# Altium schematic sheet VTRX.SchDoc: VTRX+
size A; DocumentNumber: 7; SheetNumber: 7; SheetTotal: 22
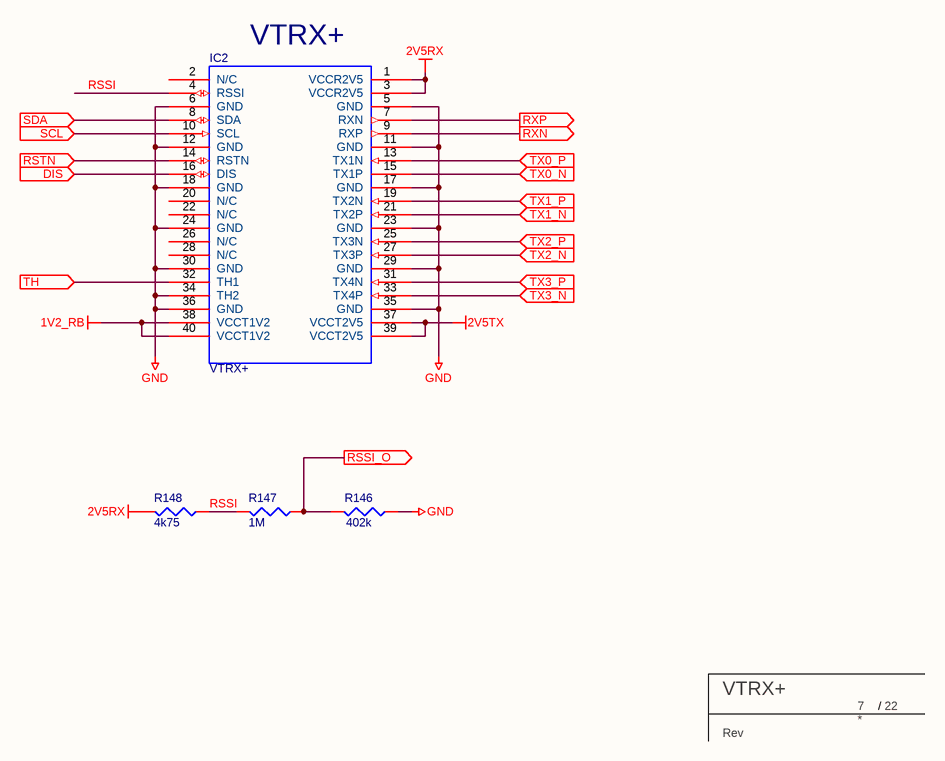
[diagram p0: VTRX.SchDoc]

## Parts
IC2  DF40C-40DS-0.4V  [vtrx+]  (value not drawn)
R146  402k  [R_0402_IPC]
R147  1M  [R_0402_IPC]
R148  4k75  [R_0402_IPC]
TBLOCK?  BU Title block  (value not drawn)  (graphical)

## Ports
DIS (in), RSSI_O (out), RSTN (in), RXN (out), RXP (out), SCL (in), SDA (in), TH (in), TX0_N (in), TX0_P (in), TX1_N (in), TX1_P (in), TX2_N (in), TX2_P (in), TX3_N (in), TX3_P (in)

## Nets
1V2_RB: IC2.38(VCCT1V2) IC2.40(VCCT1V2)
2V5RX: IC2.1(VCCR2V5) IC2.3(VCCR2V5) R148.2
2V5TX: IC2.37(VCCT2V5) IC2.39(VCCT2V5)
GND: IC2.5(GND) IC2.6(GND) IC2.11(GND) IC2.12(GND) IC2.17(GND) IC2.18(GND) IC2.23(GND) IC2.24(GND) IC2.29(GND) IC2.30(GND) IC2.34(TH2) IC2.35(GND) IC2.36(GND) R146.1
DIS: IC2.16(DIS) ; port DIS
RSSI: IC2.4(RSSI) R147.2 R148.1
RSSI_O: R146.2 R147.1 ; port RSSI_O
RSTN: IC2.14(RSTN) ; port RSTN
RXN: IC2.9(RXP) ; port RXN
RXP: IC2.7(RXN) ; port RXP
SCL: IC2.10(SCL) ; port SCL
SDA: IC2.8(SDA) ; port SDA
TH: IC2.32(TH1) ; port TH
TX0_N: IC2.15(TX1P) ; port TX0_N
TX0_P: IC2.13(TX1N) ; port TX0_P
TX1_N: IC2.21(TX2P) ; port TX1_N
TX1_P: IC2.19(TX2N) ; port TX1_P
TX2_N: IC2.27(TX3P) ; port TX2_N
TX2_P: IC2.25(TX3N) ; port TX2_P
TX3_N: IC2.33(TX4P) ; port TX3_N
TX3_P: IC2.31(TX4N) ; port TX3_P

Not connected (* = marked no-connect by the designer): IC2 2(N/C) 20(N/C) 22(N/C) 26(N/C) 28(N/C)

## Notes on the sheet
- (near IC2) VTRX+
- (in symbol TITLE_BLOCK_BU) /; Rev

## Library data of the parts
IC2 = VTRX+_DF40C-2.0-40DS-0.4V: VTRX+ module with 2.5mm stack Height.; Parameter 1: VTRX+
R146 = R-E5-402k0-0402-1%: RES SMD 402K OHM 1% 1/16W 0402; Part Number: RR0510P-103-D
R147 = R-E6-1M0-0402-1%: RES SMD 1M OHM 1% 1/16W 0402; Part Number: ERJ-2RKF4751X0402
R148 = R-E3-4K75-0402-1%: RES SMD 4.75K OHM 1% 1/10W 0402; Part Number: ERJ-2RKF4751X0402
TBLOCK? = TITLE_BLOCK_BU